# EAGLE design twomics_sw_led_v2 (EAGLE 7.7.0)
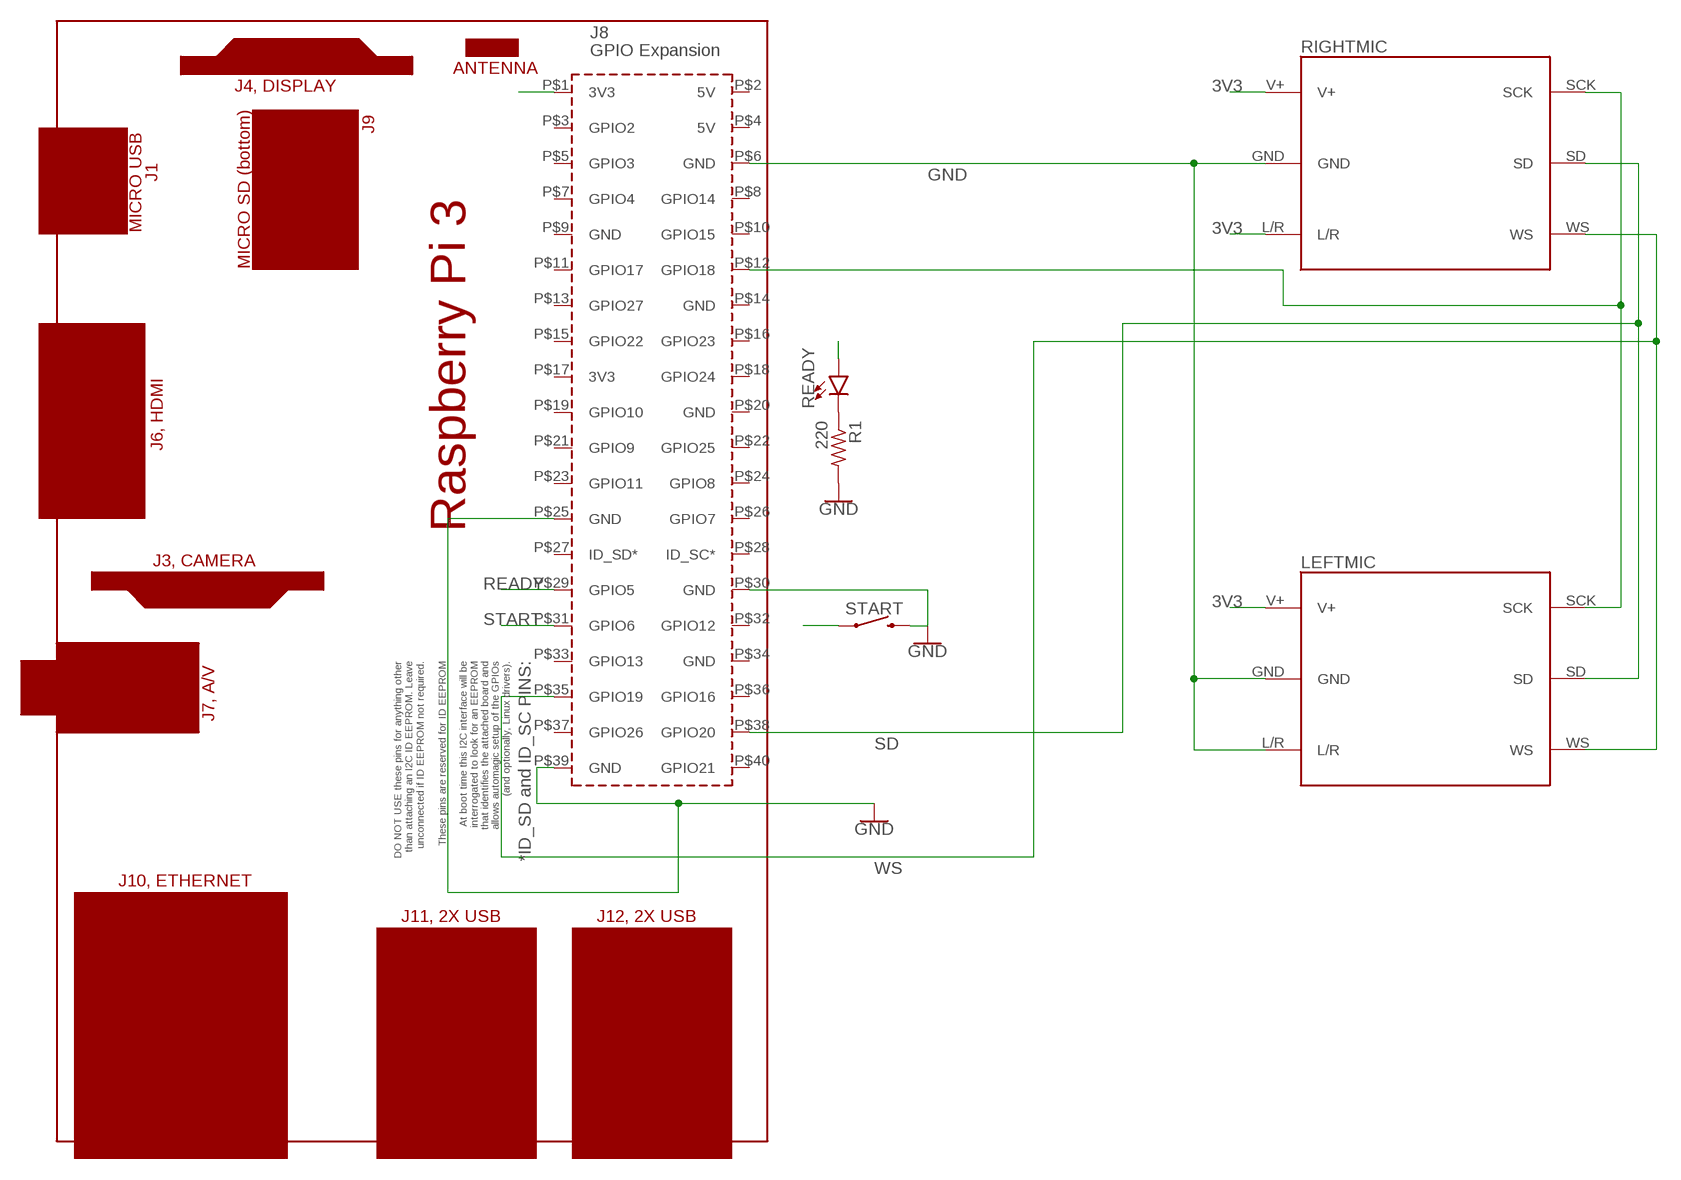
[diagram p0: schematic, sheet 1]

## Parts
LEFTMIC  EMMIC-ICS43432  [PTH]
PCB1  RPI3_40_PIN  [40_PIN]
R1  220  R-US_0207/7  [0207/7]
READY  LED3MM  [LED_3MM]
RIGHTMIC  EMMIC-ICS43432  [PTH]
START  MOMENTARY-SWITCH-SPST-PTH-6.0MM  [TACTILE_SWITCH_PTH_6.0MM]

## Nets
3V3: LEFTMIC.V+ PCB1.P$1(3V3) RIGHTMIC.L/R RIGHTMIC.V+
GND: LEFTMIC.GND LEFTMIC.L/R PCB1.P$6(GND) PCB1.P$25(GND) PCB1.P$30(GND) PCB1.P$39(GND) R1.2 RIGHTMIC.GND START.3
N$1: R1.1 READY.K(C)
READY: PCB1.P$29(GPIO5) READY.A
SCK: LEFTMIC.SCK PCB1.P$12(GPIO18) RIGHTMIC.SCK
SD: LEFTMIC.SD PCB1.P$38(GPIO20) RIGHTMIC.SD
START: PCB1.P$31(GPIO6) START.1
WS: LEFTMIC.WS PCB1.P$35(GPIO19) RIGHTMIC.WS
Unconnected: PCB1.P$2(5V) PCB1.P$3(GPIO2) PCB1.P$4(5V) PCB1.P$5(GPIO3) PCB1.P$7(GPIO4) PCB1.P$8(GPIO14) PCB1.P$9(GND) PCB1.P$10(GPIO15) PCB1.P$11(GPIO17) PCB1.P$13(GPIO27) PCB1.P$14(GND) PCB1.P$15(GPIO22) PCB1.P$16(GPIO23) PCB1.P$17(3V3) PCB1.P$18(GPIO24) PCB1.P$19(GPIO10) PCB1.P$20(GND) PCB1.P$21(GPIO9) PCB1.P$22(GPIO25) PCB1.P$23(GPIO11) PCB1.P$24(GPIO8) PCB1.P$26(GPIO7) PCB1.P$27(ID_SD*) PCB1.P$28(ID_SC*) PCB1.P$32(GPIO12) PCB1.P$33(GPIO13) PCB1.P$34(GND) PCB1.P$36(GPIO16) PCB1.P$37(GPIO26) PCB1.P$40(GPIO21)

## Library data of the parts
LEFTMIC RIGHTMIC = invensense:EMMIC-ICS43432
PCB1 = e14_Rpi3_RevA:RPI3_40_PIN: Device for Raspberry Pi 3 without an associated 40 pin header package created by Dave Young for www.element14.com.
R1 = resistor:R-US_: RESISTOR, American symbol
READY = SparkFun-LED:LED: LED (Generic) Standard schematic elements and footprints for 5mm, 3mm, 1206, and 0603 sized LEDs. Generic LEDs with no color specified.; PROD_ID: DIO-08794
START = SparkFun-Switches:MOMENTARY-SWITCH-SPST: Momentary Switch (Pushbutton) - SPST Normally-open (NO) SPST momentary switches (buttons, pushbuttons). Variants PTH-12MM - 12mm square, through-hole Momentary Pushbutton Switch - 12mm Square <https://www.sparkfun.com/products/9190> (COM-09190) PTH-6.0MM, PTH-6.0MM-KIT - 6.0mm square, through-hole Mini Pushbutton Switch <https://www.sparkfun.com/products/97> (COM-00097) KIT package intended for soldering kit's - only one side of pads' copper is exposed. PTH-RIGHT-ANGLE-KIT - Right-angle, through-hole Right Angle Tactile Button <https://www.sparkfun.com/products/10791> - Used on SparkFun BigTime Watch Kit <https://www.sparkfun.com/products/11734> SMD-12MM - 12mm square, surface-mount Tactile Button - SMD (12mm) <https://www.sparkfun.com/products/12993> (COM-12993) Used on SparkFun PicoBoard <https://www.sparkfun.com/products/11888> SMD-4.5MM - 4.5mm Square Trackball Switch Used on SparkFun Blackberry Trackballer Breakout <https://www.sparkfun.com/products/13169> SMD-4.6MMX2.8MM - 4.60mm x 2.80mm, surface mount Used on SparkFun SAMD21 Mini Breakout <https://www.sparkfun.com/products/13664> SMD-5.2MM, SMD-5.2-REDUNDANT - 5.2mm square, surface-mount Mini Pushbutton Switch - SMD <https://www.sparkfun.com/products/8720> (COM-08720) Used on Arduino Pro Mini <https://www.sparkfun.com/products/11114> REDUNDANT package connects both switch circuits together SMD-6.0X3.5MM - 6.0 x 3.5mm, surface mount Momentary Reset Switch SMD <https://www.sparkfun.com/products/8229> (COM-08229) SMD-6.2MM-TALL - 6.2mm square, surface mount Tactile Button - SMD (6mm) <https://www.sparkfun.com/products/12992> Used on SparkFun Digital Sandbox <https://www.sparkfun.com/products/12651> SMD-RIGHT-ANGLE - Right-angle, surface mount Used on SparkFun Block for Intel® Edison - Arduino <https://www.sparkfun.com/products/13036>; PROD_ID: SWCH-08441; SF_SKU: COM-00097

## Board
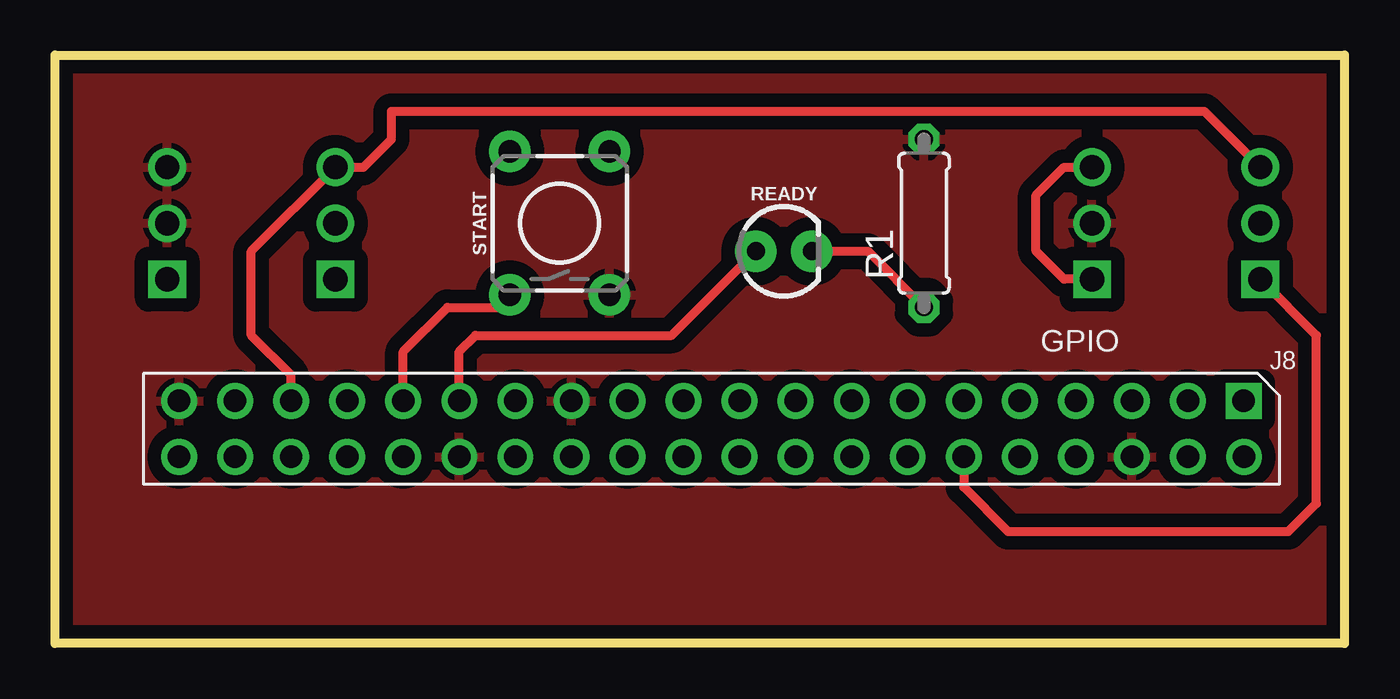
[diagram p1: board, top side]
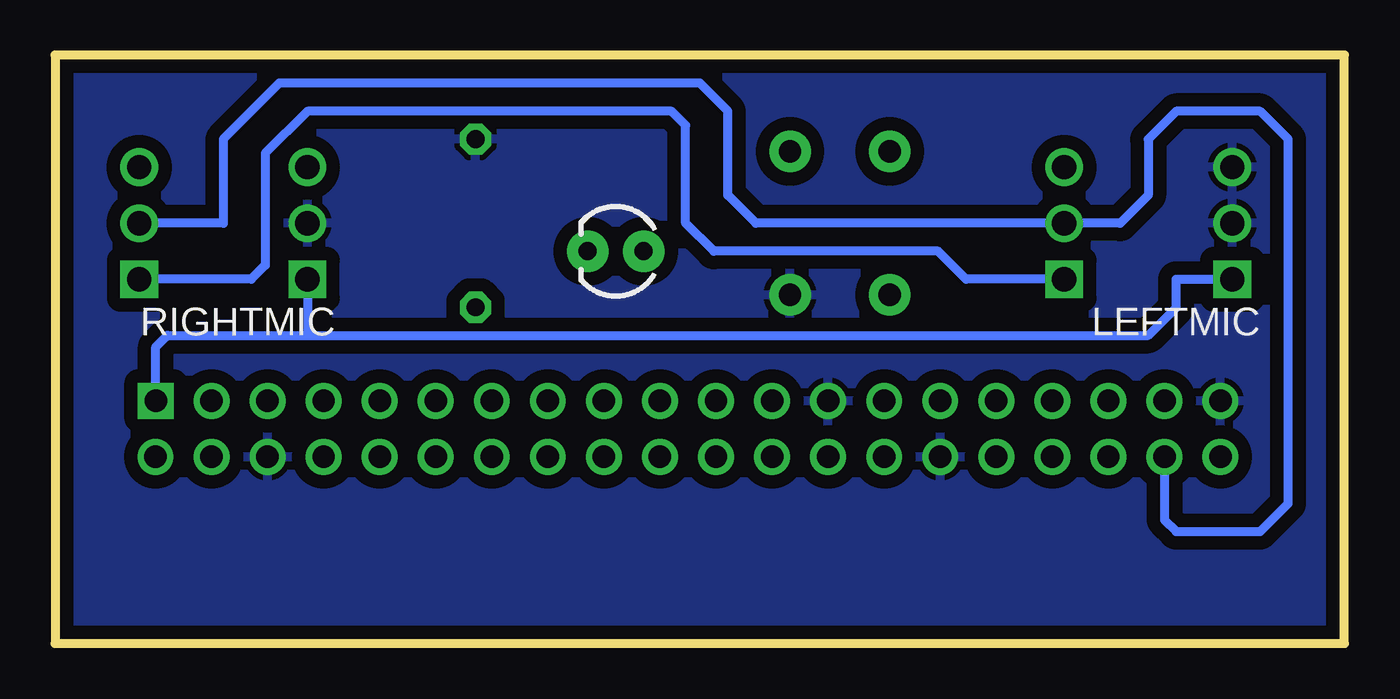
[diagram p2: board, bottom side, seen from below]

Size 58.42 x 26.67 mm. Coordinates in mm from the lower left corner, seen from the top.
Outline: 0,26.67 58.42,26.67 58.42,0 0,0 0,26.67
Copper layers (1*16): Top 0.035mm / dielectric 1.5mm / Bottom 0.035mm
Design rules "SparkFun": minimum track width 8mil, minimum drill 20mil, track to track 8mil, track to pad 8mil, pad to pad 8mil, via to via 8mil, smd to smd 8mil, copper to edge 8mil, drill to drill 8mil, minimum pad ring 12mil, minimum via ring 10mil, stop-mask expansion 4mil, vias tented up to drill 20mil, thermal gap 10mil

### Footprints (pad centres in the part's own frame; a part is rotated, then mirrored left to right if it is on the bottom)
PTH = drill 1.1: GND -3.81,0; L/R -3.81,-2.54; SD 3.81,0; WS 3.81,-2.54 | drill 1.1 square: SCK 3.81,2.54; V+ -3.81,2.54
40_PIN = drill 1.016 square: P$1 2.02,1.7 | drill 1.016: P$2 2.007,4.242; P$3 4.547,1.702; P$4 4.547,4.242; P$5 7.087,1.702; P$6 7.087,4.242; P$7 9.627,1.702; P$8 9.627,4.242; P$9 12.167,1.702; P$10 12.167,4.242; P$11 14.707,1.702; P$12 14.707,4.242; P$13 17.247,1.702; P$14 17.247,4.242; P$15 19.787,1.702; P$16 19.787,4.242; P$17 22.327,1.702; P$18 22.327,4.242; P$19 24.867,1.702; P$20 24.867,4.242; P$21 27.407,1.702; P$22 27.407,4.242; P$23 29.947,1.702; P$24 29.947,4.242; P$25 32.487,1.702; P$26 32.487,4.242; P$27 35.027,1.702; P$28 35.027,4.242; P$29 37.567,1.702; P$30 37.567,4.242; P$31 40.107,1.702; P$32 40.107,4.242; P$33 42.647,1.702; P$34 42.647,4.242; P$35 45.187,1.702; P$36 45.187,4.242; P$37 47.727,1.702; P$38 47.727,4.242; P$39 50.267,1.702; P$40 50.267,4.242
0207/7 = drill 0.813 octagon: 1 -3.81,0; 2 3.81,0
LED_3MM = drill 0.813 pad 1.88: A -1.27,0; K 1.27,0
TACTILE_SWITCH_PTH_6.0MM = drill 1.016 pad 1.88: 1 -3.251,2.261; 2 3.251,2.261; 3 -3.251,-2.261; 4 3.251,-2.261

### Placement (x,y rotation side)
LEFTMIC  8.89,19.05 180 bottom
PCB1  55.88,12.7 180 top
R1  39.37,19.05 90 top
READY  33.02,17.78 0 top
RIGHTMIC  50.8,19.05 180 bottom
START  22.86,19.05 90 top

### Tracks (layer width: path | path; a pad name or v marks a point on that pad's centre or on a via)
3V3
  Top 0.406: RIGHTMIC.V+ 45.72,16.51 44.45,17.78 44.45,20.32 45.72,21.59 RIGHTMIC.L/R
  Bottom 0.406: PCB1.P$1 53.86,13.45 53.34,13.97 46.99,13.97 | 46.99,13.97 8.89,13.97 7.62,15.24 7.62,16.51 LEFTMIC.V+ | RIGHTMIC.V+ 46.99,13.97
GND
  pour Bottom (isolate 0.61): 0,26.67 58.42,26.67 58.42,0 0,0
  pour Top (isolate 0.61): 0,26.67 58.42,26.67 58.42,0 0,0
N$1
  Top 0.406: READY.K 36.83,17.78 R1.1
READY
  Top 0.406: PCB1.P$29 18.31,13.23 19.05,13.97 27.94,13.97 READY.A
SCK
  Top 0.406: PCB1.P$12 41.17,7.09 43.18,5.08 55.88,5.08 57.15,6.35 57.15,13.97 RIGHTMIC.SCK
  Bottom 0.406: LEFTMIC.SCK 17.14,16.51 18.42,17.78 28.57,17.78 29.85,19.05 29.85,23.5 30.48,24.13 46.99,24.13 48.89,22.22 48.89,17.14 49.53,16.51 RIGHTMIC.SCK
SD
  Bottom 0.406: RIGHTMIC.SD 50.8,19.05 50.8,22.86 48.26,25.4 29.21,25.4 27.94,24.13 27.94,20.32 26.67,19.05 LEFTMIC.SD 10.16,19.05 8.89,20.32 8.89,22.86 7.62,24.13 3.81,24.13 2.54,22.86 2.54,6.35 3.81,5.08 7.62,5.08 8.15,5.61 PCB1.P$38
START
  Top 0.406: PCB1.P$31 15.77,13.23 17.78,15.24 20.04,15.24 START.1
WS
  Top 0.406: RIGHTMIC.WS 52.07,24.13 15.24,24.13 15.24,22.86 13.97,21.59 LEFTMIC.WS 8.89,17.78 8.89,13.97 10.69,12.17 PCB1.P$35